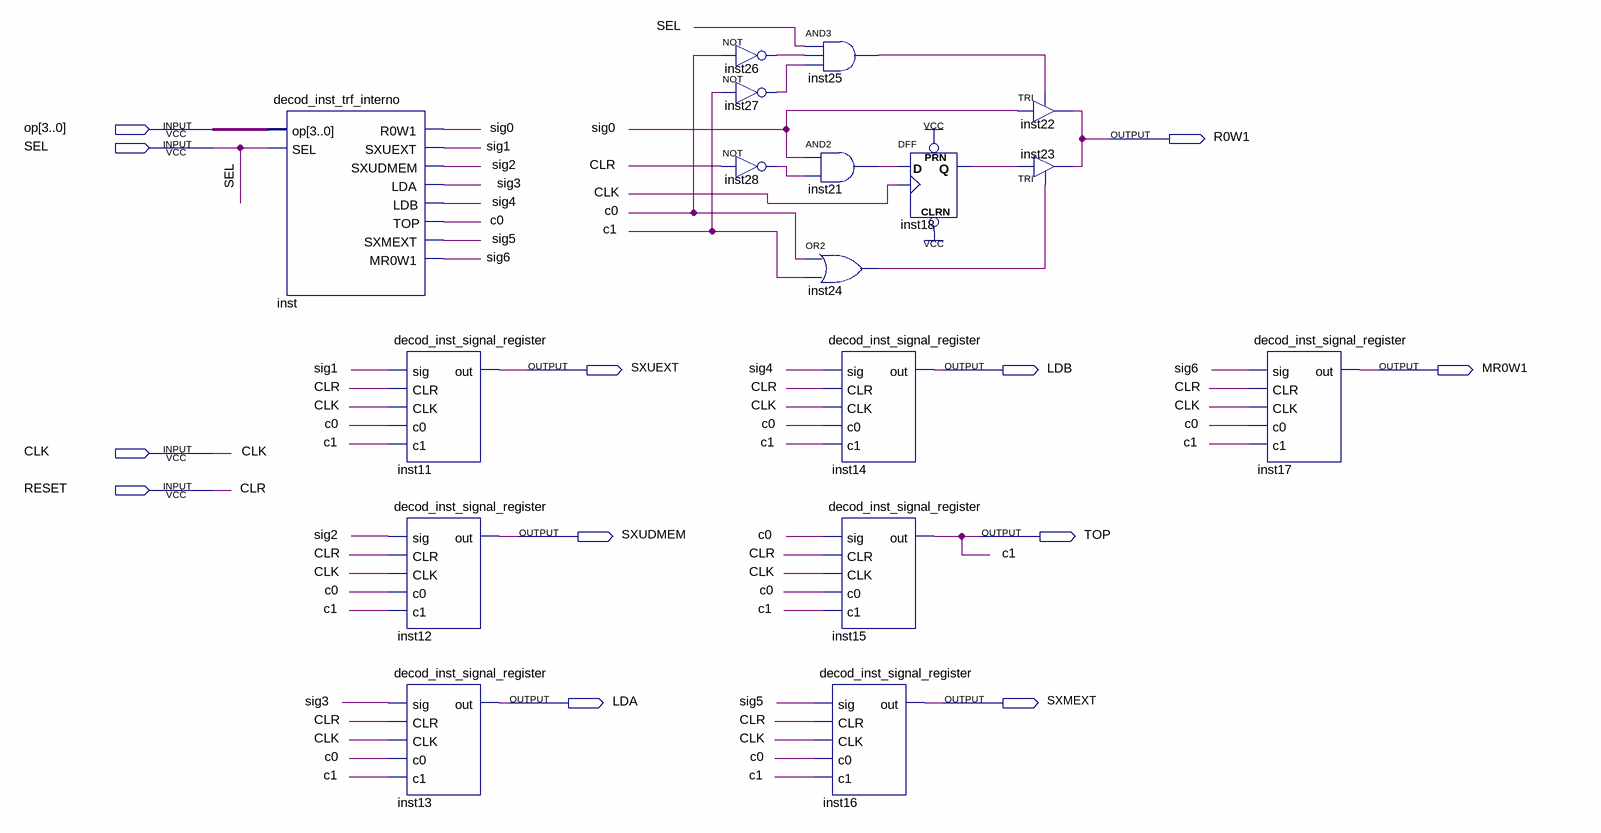
[diagram p0: schematic sheet]
// Quartus schematic decod_inst_trf.bdf as structural Verilog: 17 symbols, 12 pins
module decod_inst_trf (
  input  [3:0] op,
  input  SEL,
  input  CLK,
  input  RESET,
  output R0W1,
  output SXUEXT,
  output LDB,
  output MR0W1,
  output SXUDMEM,
  output TOP,
  output LDA,
  output SXMEXT
);

  wire c0, inst18_q, inst21_out, inst24_out, inst25_out, inst26_out, inst27_out, inst28_out, sig0, sig1,
       sig2, sig3, sig4, sig5, sig6;

  decod_inst_trf_interno inst (
    .op(op), .SEL(SEL), .R0W1(sig0), .TOP(c0), .SXUEXT(sig1), .SXUDMEM(sig2), .SXMEXT(sig5), .LDA(sig3),
    .MR0W1(sig6), .LDB(sig4));
  decod_inst_signal_register inst11 (.sig(sig1), .CLR(RESET), .CLK(CLK), .c0(c0), .c1(TOP), .out(SXUEXT));
  decod_inst_signal_register inst12 (.sig(sig2), .CLR(RESET), .CLK(CLK), .c0(c0), .c1(TOP), .out(SXUDMEM));
  decod_inst_signal_register inst13 (.sig(sig3), .CLR(RESET), .CLK(CLK), .c0(c0), .c1(TOP), .out(LDA));
  not inst26 (inst26_out, c0);
  not inst27 (inst27_out, TOP);
  not inst28 (inst28_out, RESET);
  and inst25 (inst25_out, SEL, inst26_out, inst27_out);
  and inst21 (inst21_out, sig0, inst28_out);
  or inst24 (inst24_out, c0, TOP);
  decod_inst_signal_register inst14 (.sig(sig4), .CLR(RESET), .CLK(CLK), .c0(c0), .c1(TOP), .out(LDB));
  decod_inst_signal_register inst15 (.sig(c0), .CLR(RESET), .CLK(CLK), .c0(c0), .c1(TOP), .out(TOP));
  decod_inst_signal_register inst16 (.sig(sig5), .CLR(RESET), .CLK(CLK), .c0(c0), .c1(TOP), .out(SXMEXT));
  DFF inst18 (.CLRN(1'b1), .CLK(CLK), .D(inst21_out), .PRN(1'b1), .Q(inst18_q));
  TRI inst22 (.IN(sig0), .OE(inst25_out), .OUT(R0W1));
  TRI inst23 (.IN(inst18_q), .OE(inst24_out), .OUT(R0W1));
  decod_inst_signal_register inst17 (.sig(sig6), .CLR(RESET), .CLK(CLK), .c0(c0), .c1(TOP), .out(MR0W1));

  // Other names for the same wires on the sheet: c1 = TOP; CLR = RESET
endmodule
